# Altium schematic sheet [5]LCD.SchDoc
size A
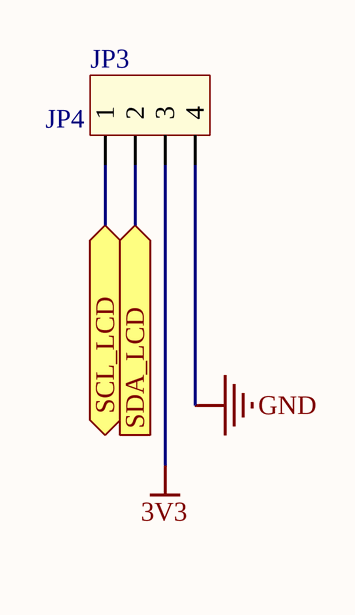
[diagram p0: [5]LCD.SchDoc]

## Parts
JP3  JP4  [CON4]

## Ports
SCL_LCD (bidir), SDA_LCD (in)

## Nets
3V3: JP3.3
GND: JP3.4
SCL_LCD: JP3.1 ; port SCL_LCD
SDA_LCD: JP3.2 ; port SDA_LCD

## Library data of the parts
JP3 = Con4: Connector 4; Value: Connector 4